# EAGLE schematic motorModule-0.2 (EAGLE 7.6.0)
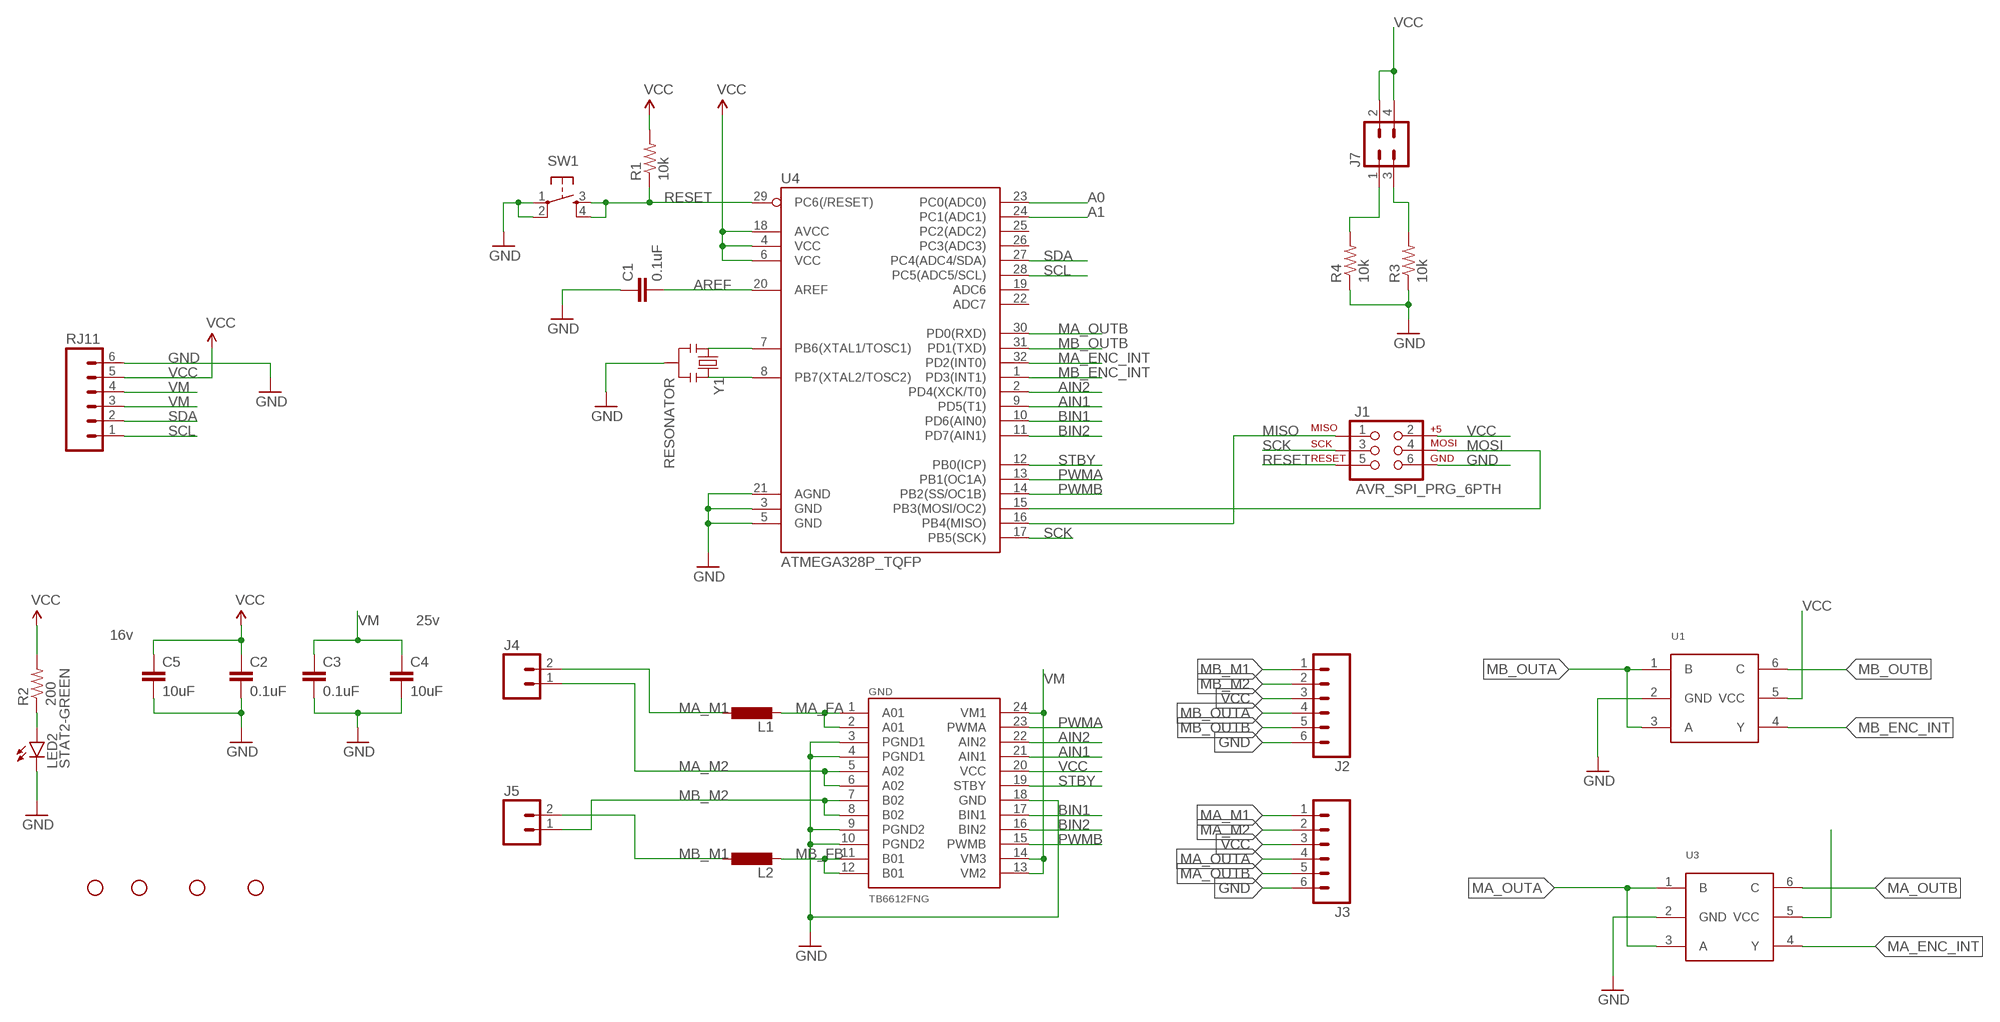
[diagram p0: schematic, sheet 1]

## Parts
C1  0.1uF  CAP0603-CAP  [0603-CAP]
C2  0.1uF  CAP0603-CAP  [0603-CAP]
C3  0.1uF  CAP0603-CAP  [0603-CAP]
C4  10uF  CAP0805  [0805]
C5  10uF  CAP0805  [0805]
GND  TB6612FNG  [SSOP24]
H1  STAND-OFFPLATED  [STAND-OFF-PLATED]
H2  STAND-OFFPLATED  [STAND-OFF-PLATED]
H3  STAND-OFFPLATED  [STAND-OFF-PLATED]
H4  STAND-OFFPLATED  [STAND-OFF-PLATED]
J1  AVR_SPI_PRG_6PTH  [2X3]
J2  M06JST-PH-6TH  [JST-PH-6-TH]
J3  M06JST-PH-6TH  [JST-PH-6-TH]
J4  M02JST-PTH-VERT  [JST-2-PTH-VERT]
J5  M02JST-PTH-VERT  [JST-2-PTH-VERT]
J7  M02X2  [2X2]
L1  L-EUL1812  [L1812]
L2  L-EUL1812  [L1812]
LED2  STAT2-GREEN  LED0603  [LED-0603]
R1  10k  RESISTOR0603  [0603-RES]
R2  200  RESISTOR0603  [0603-RES]
R3  10k  RESISTOR0603  [0603-RES]
R4  10k  RESISTOR0603  [0603-RES]
RJ11  M06RJ11  [RJ11-6P6C]
SW1  SWITCH_SPST_4_PINKMR2  [TACTILE_SWITCH_SMD-3]
U1  74LVC1G58  [SOT363]
U3  74LVC1G58  [SOT363]
U4  ATMEGA328P_TQFP  [TQFP32-08]
Y1  RESONATOR  [RESONATOR-MURATA]

## Nets
A0: J7.3 R3.2 U4.23(PC0(ADC0))
A1: J7.1 R4.2 U4.24(PC1(ADC1))
AIN1: GND.21(AIN1) U4.9(PD5(T1))
AIN2: GND.22(AIN2) U4.2(PD4(XCK/T0))
AREF: C1.2 U4.20(AREF)
BIN1: GND.17(BIN1) U4.10(PD6(AIN0))
BIN2: GND.16(BIN2) U4.11(PD7(AIN1))
GND: C1.1 C2.2 C3.2 C4.2 C5.2 GND.3(PGND1) GND.4(PGND1) GND.9(PGND2) GND.10(PGND2) GND.18(GND) J1.6 J2.6 J3.6 LED2.C R3.1 R4.1 RJ11.6 SW1.1 SW1.2 U1.2(GND) U3.2(GND) U4.3(GND) U4.5(GND) U4.21(AGND) Y1.2
MA_ENC_INT: U3.4(Y) U4.32(PD2(INT0))
MA_FA: GND.1(A01) GND.2(A01) L1.2
MA_M1: J3.1 J4.2 L1.1
MA_M2: GND.5(A02) GND.6(A02) J3.2 J4.1
MA_OUTA: J3.4 U3.1(B) U3.3(A)
MA_OUTB: J3.5 U3.6(C) U4.30(PD0(RXD))
MB_ENC_INT: U1.4(Y) U4.1(PD3(INT1))
MB_FB: GND.11(B01) GND.12(B01) L2.2
MB_M1: J2.1 J5.2 L2.1
MB_M2: GND.7(B02) GND.8(B02) J2.2 J5.1
MB_OUTA: J2.4 U1.1(B) U1.3(A)
MB_OUTB: J2.5 U1.6(C) U4.31(PD1(TXD))
MISO: J1.1 U4.16(PB4(MISO))
MOSI: J1.4 U4.15(PB3(MOSI/OC2))
N$1: U4.7(PB6(XTAL1/TOSC1)) Y1.1
N$2: U4.8(PB7(XTAL2/TOSC2)) Y1.3
N$3: LED2.A R2.1
PWMA: GND.23(PWMA) U4.13(PB1(OC1A))
PWMB: GND.15(PWMB) U4.14(PB2(SS/OC1B))
RESET: J1.5 R1.1 SW1.3 SW1.4 U4.29(PC6(/RESET))
SCK: J1.3 U4.17(PB5(SCK))
SCL: RJ11.1 U4.28(PC5(ADC5/SCL))
SDA: RJ11.2 U4.27(PC4(ADC4/SDA))
STBY: GND.19(STBY) U4.12(PB0(ICP))
VCC: C2.1 C5.1 GND.20(VCC) J1.2 J2.3 J3.3 J7.2 J7.4 R1.2 R2.2 RJ11.5 U1.5(VCC) U3.5(VCC) U4.4(VCC) U4.6(VCC) U4.18(AVCC)
VM: C3.1 C4.1 GND.13(VM2) GND.14(VM3) GND.24(VM1) RJ11.3 RJ11.4
Unconnected: U4.19(ADC6) U4.22(ADC7) U4.25(PC2(ADC2)) U4.26(PC3(ADC3))

## Notes on the sheet
- 25v
- 16v

## Library data of the parts
C1-C5 = SparkFun-Capacitors:CAP: Capacitor Standard 0603 ceramic capacitor, and 0.1" leaded capacitor.
GND = SparkFun-PowerIC:TB6612FNG: Toshiba 1A dual motor driver IC-09363; PROD_ID: IC-09363
H1-H4 = Robotois:STAND-OFF: #4 Stand Off This is the mechanical footprint for a #4 phillips button head screw. Use the keepout ring to avoid running the screw head into surrounding components. SKU : PRT-00447
J1 = Robotois:AVR_SPI_PRG_6: AVR ISP 6 Pin This is the reduced ISP connector for AVR programming. Common on Arduino. This footprint will take up less PCB space and can be used with a 10-pin to 6-pin adapter such as SKU: BOB-08508
J2 J3 RJ11 = Robotois:M06: Header 6 Standard 6-pin 0.1" header. Use with straight break away headers (SKU : PRT-00116), right angle break away headers (PRT-00553), swiss pins (PRT-00743), machine pins (PRT-00117), and female headers (PRT-00115). Molex polarized connector foot print use with SKU : PRT-08094 with associated crimp pins and housings. NOTES ON THE VARIANTS LOCK and LOCK_LONGPADS... This footprint was designed to help hold the alignment of a through-hole component (i.e. 6-pin header) while soldering it into place. You may notice that each hole has been shifted either up or down by 0.005 of an inch from it's more standard position (which is a perfectly straight line). This slight alteration caused the pins (the squares in the middle) to touch the edges of the holes. Because they are alternating, it causes a "brace" to hold the component in place. 0.005 has proven to be the perfect amount of "off-center" position when using our standard breakaway headers. Although looks a little odd when you look at the bare footprint, once you have a header in there, the alteration is very hard to notice. Also,if you push a header all the way into place, it is covered up entirely on the bottom side. This idea of altering the position of holes to aid alignment will be further integrated into the Sparkfun Library for other footprints. It can help hold any component with 3 or more connection pins.
J4 J5 = Robotois:M02: Standard 2-pin 0.1" header. Use with - straight break away headers ( PRT-00116) - right angle break away headers (PRT-00553) - swiss pins (PRT-00743) - machine pins (PRT-00117) - female headers (PRT-00115) Molex polarized connector foot print use with: PRT-08233 with associated crimp pins and housings. 2.54_SCREWTERM for use with PRT-10571. 3.5mm Screw Terminal footprints for PRT-08084 5mm Screw Terminal footprints for use with PRT-08432
J7 = Robotois:M02X2: .1" header, two rows of four.
L1 L2 = arduino_Uno_Rev3-02-TH:L-EU: INDUCTOR, European symbol
LED2 = SparkFun-LED:LED: LEDs Standard schematic elements and footprints for 5mm, 3mm, 1206, and 0603 sized LEDs. 5mm - Spark Fun Electronics SKU : COM-00529 (and others)
R1-R4 = SparkFun-Resistors:RESISTOR: Resistor Basic schematic elements and footprints for 0603, 1206, and PTH resistors.
SW1 = Robotois:SWITCH_SPST_4_PIN
U1 U3 = Robotois:74LVC1G58: 74LVC1G58. The 74LVC1G58 provides configurable multiple functions. The output state is determined by eight patterns of 3-bit input. The user can choose the logic functions AND, OR, NAND, NOR, XOR, inverter and buffer. All inputs can be connected to VCC or GND.
U4 = SparkFun-DigitalIC:ATMEGA328P_TQFP; PROD_ID: IC-09069
Y1 = Robotois:RESONATOR: Resonator Small SMD resonator. This is the itty bitty 10/20MHz resonators with built in caps. CSTCE10M0G55 and CSTCE20M0V53. Footprint has been reviewed closely but hasn't been tested yet.